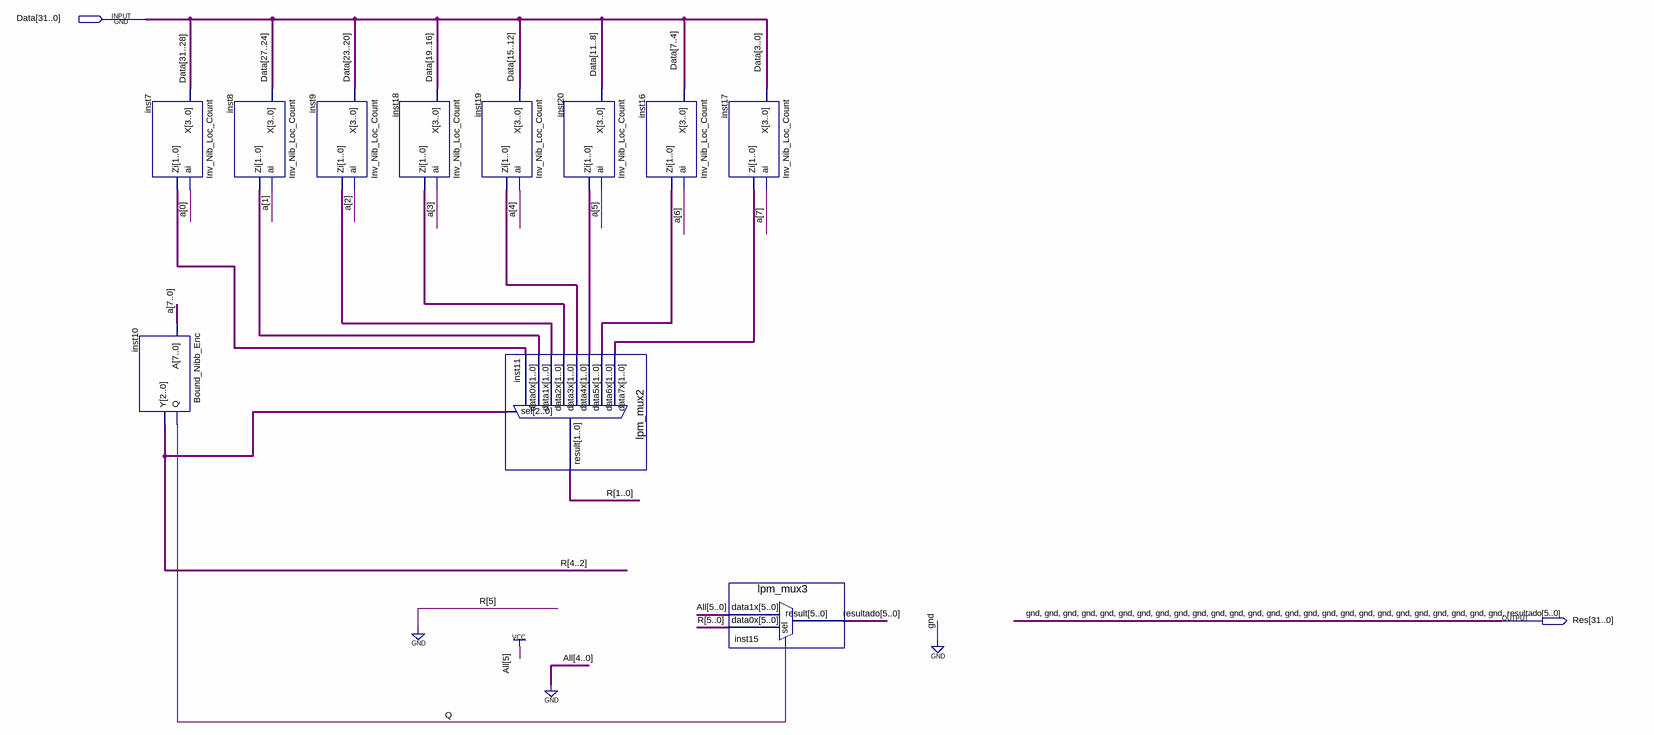
[diagram p0: schematic sheet]
// Quartus schematic CLO.bdf as structural Verilog: 11 symbols, 2 pins
module CLO (
  input  [31:0] Data,
  output [31:0] Res
);

  wire Q;
  wire [1:0] inst7_zi, inst8_zi, inst9_zi, inst16_zi, inst17_zi, inst18_zi, inst19_zi, inst20_zi;
  wire [4:0] R;
  wire [7:0] a;

  Bound_Nibb_Enc inst10 (.A(a), .Q(Q), .Y(R[4:2]));
  Inv_Nib_Loc_Count inst7 (.X(Data[31:28]), .ai(a[0]), .Zi(inst7_zi));
  Inv_Nib_Loc_Count inst8 (.X(Data[27:24]), .ai(a[1]), .Zi(inst8_zi));
  Inv_Nib_Loc_Count inst9 (.X(Data[23:20]), .ai(a[2]), .Zi(inst9_zi));
  Inv_Nib_Loc_Count inst18 (.X(Data[19:16]), .ai(a[3]), .Zi(inst18_zi));
  Inv_Nib_Loc_Count inst19 (.X(Data[15:12]), .ai(a[4]), .Zi(inst19_zi));
  lpm_mux2 inst11 (
    .data7x(inst17_zi), .data6x(inst16_zi), .data5x(inst20_zi), .data4x(inst19_zi), .data3x(inst18_zi),
    .data2x(inst9_zi), .data1x(inst8_zi), .data0x(inst7_zi), .sel(R[4:2]), .result(R[1:0]));
  Inv_Nib_Loc_Count inst20 (.X(Data[11:8]), .ai(a[5]), .Zi(inst20_zi));
  Inv_Nib_Loc_Count inst16 (.X(Data[7:4]), .ai(a[6]), .Zi(inst16_zi));
  Inv_Nib_Loc_Count inst17 (.X(Data[3:0]), .ai(a[7]), .Zi(inst17_zi));
  lpm_mux3 inst15 (.data1x(6'b100000), .data0x({1'b0, R}), .sel(Q), .result(Res[5:0]));

  assign Res[31:6] = {26{1'b0}};

  // Other names for the same wires on the sheet: resultado[5:0] = Res[5:0]
endmodule
